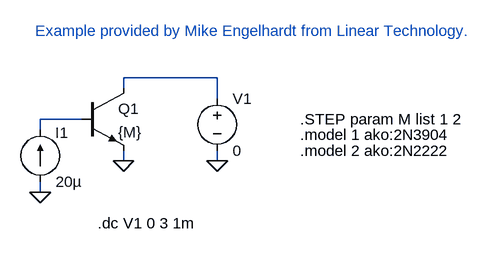
[diagram p0: schematic stepping_models_ako.asc]
stepping_models_ako.asc, the LTspice schematic file:
Version 4
SHEET 1 880 680
WIRE 32 384 32 368
WIRE 32 288 32 272
WIRE 32 272 96 272
WIRE 160 336 160 320
WIRE 160 224 160 208
WIRE 160 208 304 208
WIRE 304 208 304 240
WIRE 304 320 304 336
FLAG 32 384 0
FLAG 160 336 0
FLAG 304 336 0
SYMBOL npn 96 224 R0
SYMATTR InstName Q1
SYMATTR Value {M}
SYMBOL voltage 304 224 R0
SYMATTR InstName V1
SYMATTR Value 0
SYMBOL current 32 368 M180
WINDOW 0 23 75 Left 0
WINDOW 3 24 0 Left 0
WINDOW 123 0 0 Left 0
WINDOW 39 0 0 Left 0
SYMATTR InstName I1
SYMATTR Value 20µ
TEXT 120 432 Left 0 !.dc V1 0 3 1m
TEXT 432 272 Left 0 !.STEP param M list 1 2
TEXT 432 296 Left 0 !.model 1 ako:2N3904
TEXT 432 320 Left 0 !.model 2 ako:2N2222
TEXT 24 136 Left 0 ;Example provided by Mike Engelhardt from Linear Technology.

The netlist it stands for:
* stepping_models_ako.asc
Q1 N002 N001 0 0 {M}
V1 N002 0 0
I1 0 N001 20µ
.model NPN NPN
.model PNP PNP
.lib standard.bjt
.dc V1 0 3 1m
.STEP param M list 1 2
.model 1 ako:2N3904
.model 2 ako:2N2222
* Example provided by Mike Engelhardt from Linear Technology.
.backanno
.end